# EasyEDA schematic SCH_Pendant YSWS_2026-06-23.json
TITLE: Sheet_1; REV: 1.0; Date: 2026-06-18; Sheet: 1/1; Drawn By: esemv; Company: Your Company
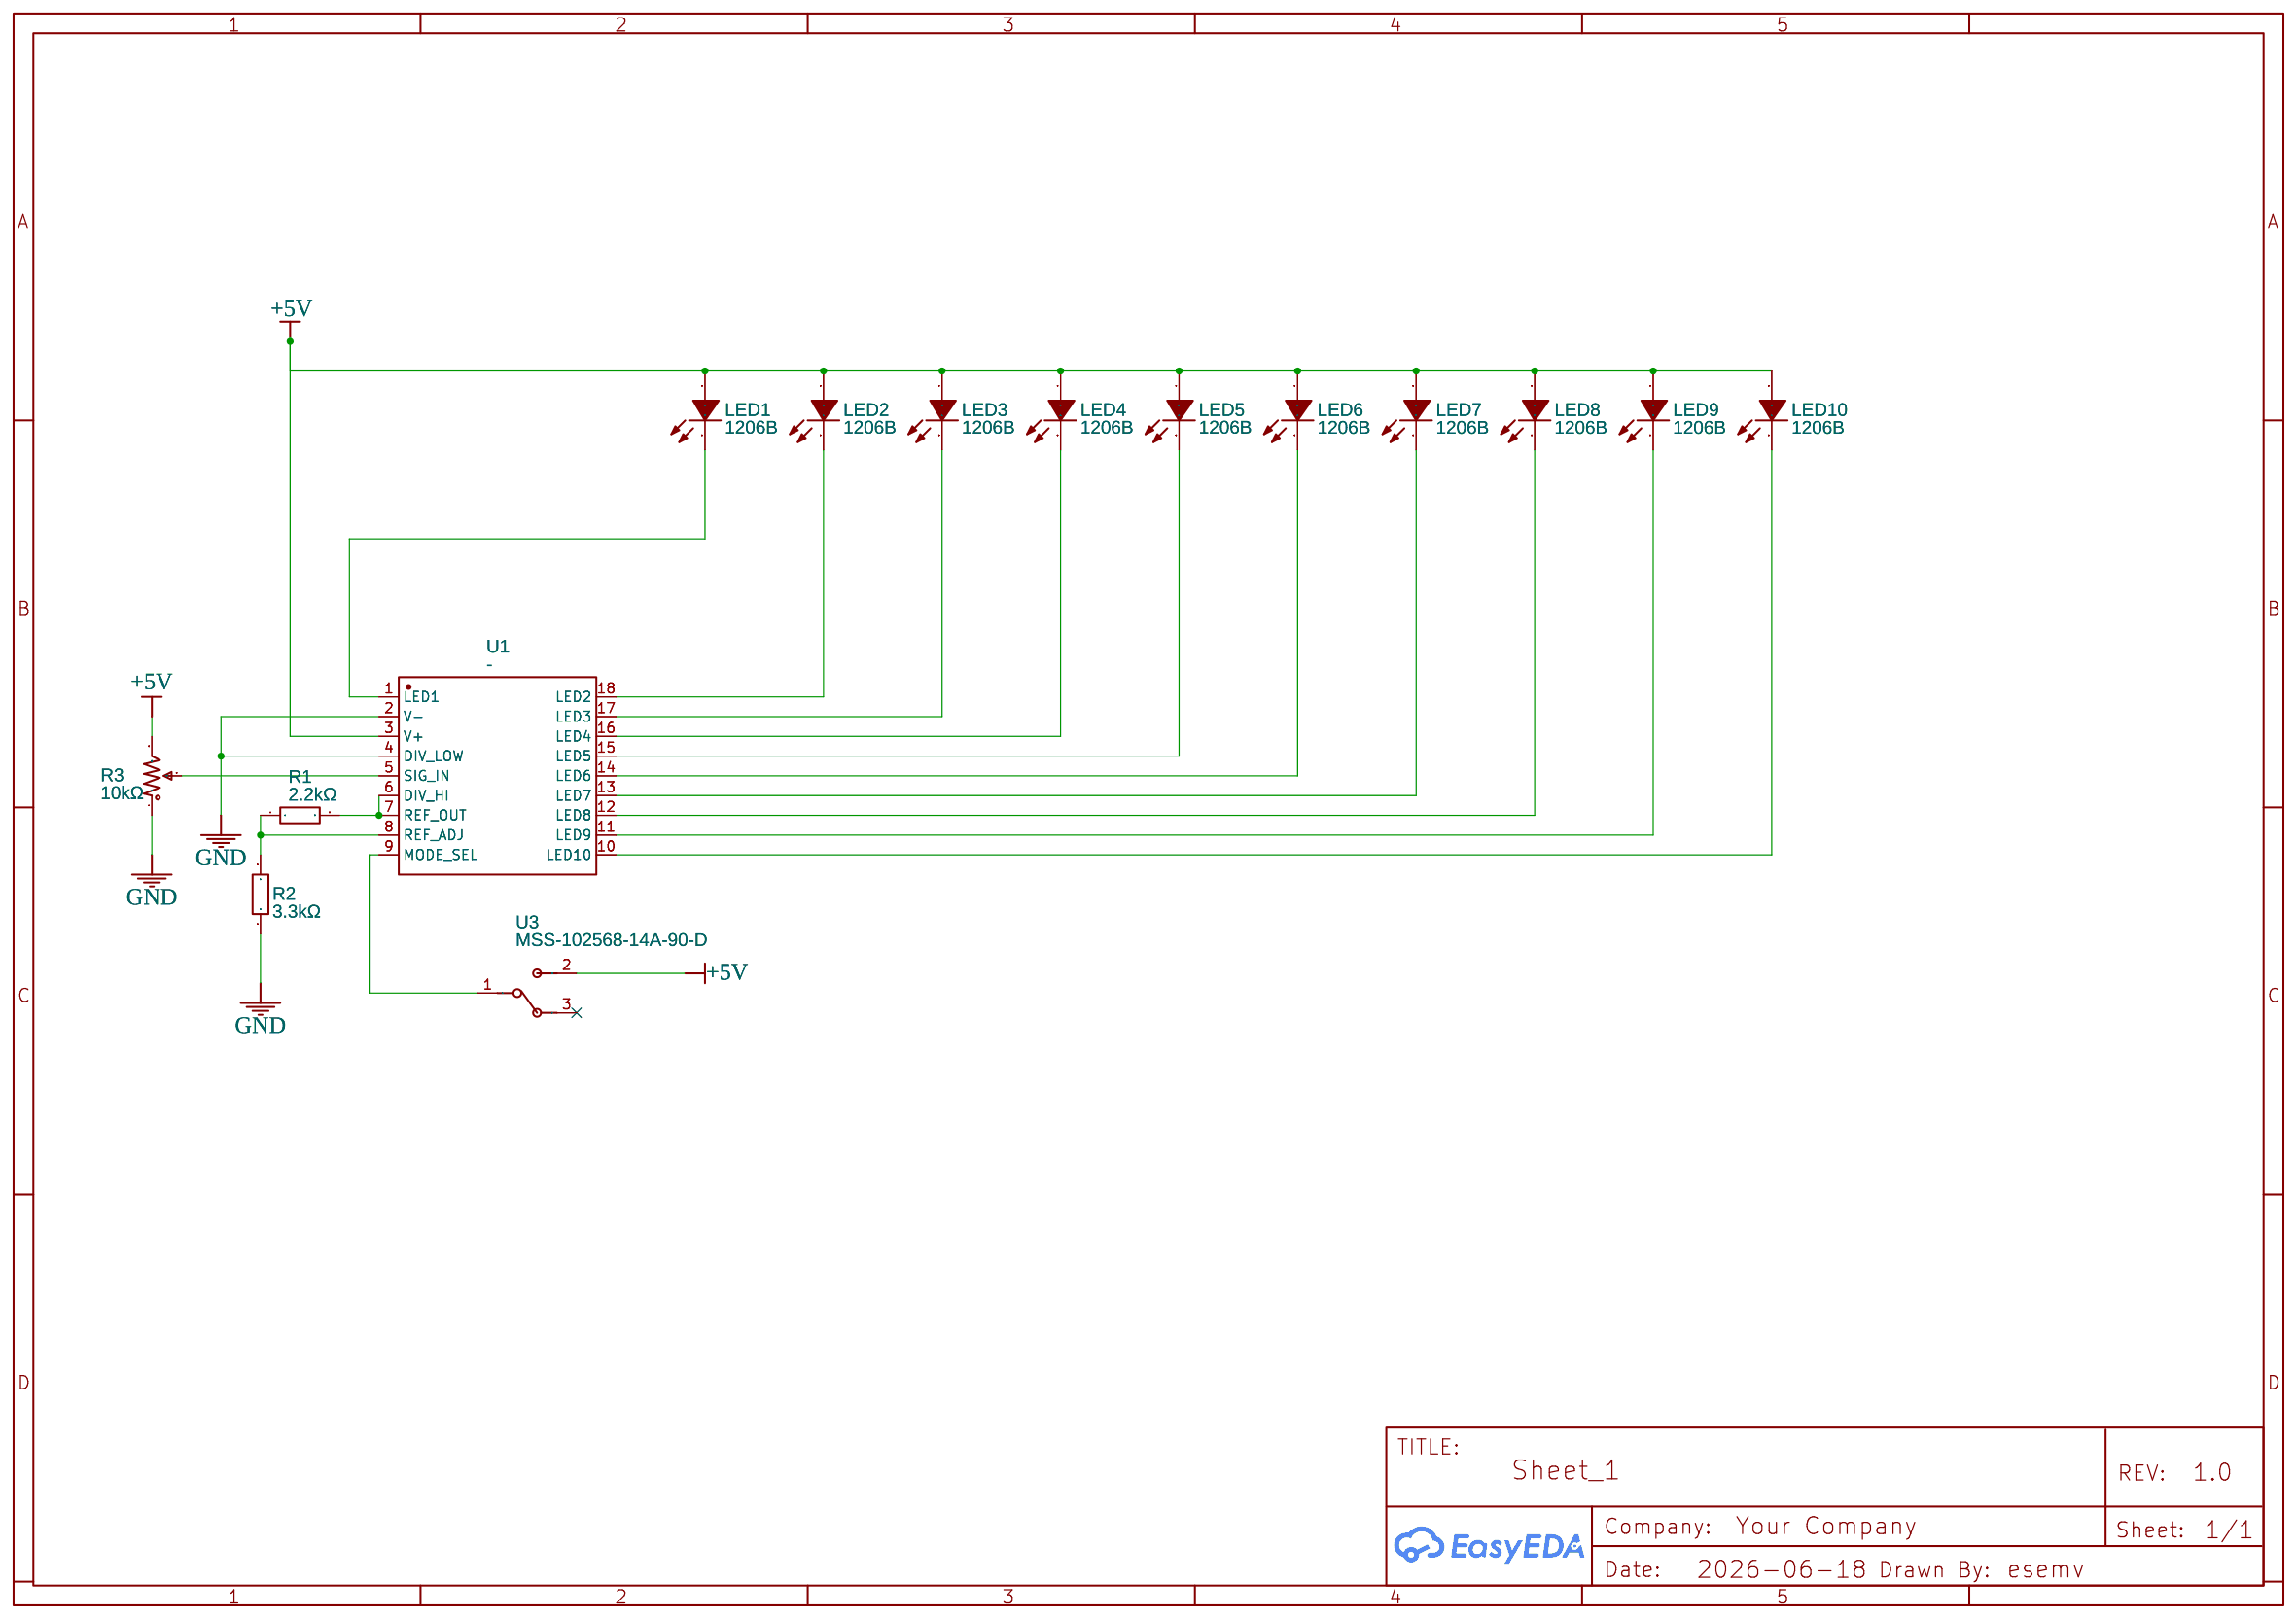
[diagram p0: schematic sheet]

## Parts
LED1  1206B  [LED1206-FD_BULE]
LED2  1206B  [LED1206-FD_BULE]
LED3  1206B  [LED1206-FD_BULE]
LED4  1206B  [LED1206-FD_BULE]
LED5  1206B  [LED1206-FD_BULE]
LED6  1206B  [LED1206-FD_BULE]
LED7  1206B  [LED1206-FD_BULE]
LED8  1206B  [LED1206-FD_BULE]
LED9  1206B  [LED1206-FD_BULE]
LED10  1206B  [LED1206-FD_BULE]
R1  2.2kΩ  [RES-TH_BD1.8-L3.2-P7.20-D0.4]
R2  3.3kΩ  [RES-TH_BD2.3-L6.5-P10.50-D0.5]
R3  10kΩ  [RES-ADJ-TH_3P-L9.5-W9.5-P2.54-BR-BS]
U1  -  [PDIP-18_L22.9-W6.4-P2.54-LS7.9-BL]
U3  MSS-102568-14A-90-D  [SW-TH_CUI_MSS-102568-14A-90-D]

## Library data of the parts
LED1-LED10 = 1206B: Supplier: LCSC; Manufacturer: KENTO; Manufacturer Part: KT-1206B; Supplier Part: C72691; JLCPCB Part Class: Extended Part; link: https://lcsc.com/eda_search?q=C72691&%26type=1&ref=editor
R1 = MF1/8W-2.2KΩ±1% T52: Contributor: LCSC; Supplier: LCSC; Supplier Part: C119186; Manufacturer: CCO(千志电子); Manufacturer Part: MF1/8W-2.2KΩ±1% T; JLCPCB Part Class: Extended Part; link: https://lcsc.com/eda_search?q=C119186&%26type=1&ref=editor
R2 = MF1/4W-3.3KΩ±1% T52: Contributor: LCSC; Supplier: LCSC; Supplier Part: C119335; Manufacturer: CCO(千志电子); Manufacturer Part: MF1/4W-3.3KΩ±1% T; JLCPCB Part Class: Extended Part; link: https://lcsc.com/eda_search?q=C119335&%26type=1&ref=editor
R3 = 3386P-1-103TLF: Resistance(Ohms): 10K; Supplier: LCSC; Manufacturer: BOURNS; Supplier Part: C116302; JLCPCB Part Class: Extended Part; link: https://lcsc.com/eda_search?q=C116302&%26type=1&ref=editor
U1 = LM3914: Contributor: LCSC; Supplier: LCSC; Supplier Part: C529246; Manufacturer: null; JLCPCB Part Class: Extended Part; link: https://lcsc.com/eda_search?q=C529246&%26type=1&ref=editor
U3 = MSS-102568-14A-90-D: Contributor: lcsc; Supplier: LCSC; Supplier Part: C3664511; Manufacturer: CUI; JLCPCB Part Class: Extended Part; link: https://lcsc.com/eda_search?q=C3664511&%26type=1&ref=editor

## Nets
+5V: LED1.1 LED2.1 LED3.1 LED4.1 LED5.1 LED6.1 LED7.1 LED8.1 LED9.1 LED10.1 R3.3 U1.3(V+) U3.2
GND: R2.1 R3.1 U1.2(V-) U1.4(DIV_LOW)
Net-(LED1-2): LED1.2 U1.1(LED1)
Net-(LED2-2): LED2.2 U1.18(LED2)
Net-(LED3-2): LED3.2 U1.17(LED3)
Net-(LED4-2): LED4.2 U1.16(LED4)
Net-(LED5-2): LED5.2 U1.15(LED5)
Net-(LED6-2): LED6.2 U1.14(LED6)
Net-(LED7-2): LED7.2 U1.13(LED7)
Net-(LED8-2): LED8.2 U1.12(LED8)
Net-(LED9-2): LED9.2 U1.11(LED9)
Net-(LED10-2): LED10.2 U1.10(LED10)
Net-(R1-1): R1.1 R2.2 U1.8(REF_ADJ)
Net-(R1-2): R1.2 U1.6(DIV_HI) U1.7(REF_OUT)
Net-(R3-2): R3.2 U1.5(SIG_IN)
Net-(U1-9): U1.9(MODE_SEL) U3.1

Not connected (* = marked no-connect by the designer): U3 3*
